# EAGLE design uncoupler-decoder (EAGLE 6.5.0)
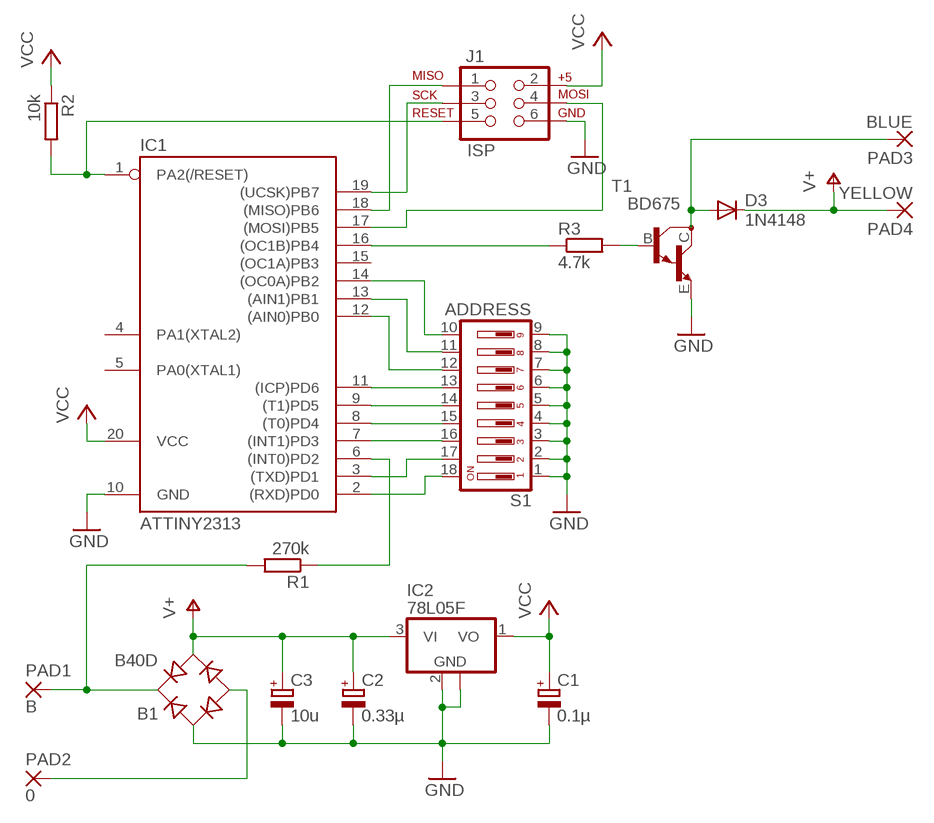
[diagram p0: schematic, sheet 1]

## Parts
B1  B40D  RECTIFIER-B40S  [B40S]
C1  0.1µ  CPOL-EUA/3216-18R  [A/3216-18R]
C2  0.33µ  CPOL-EUA/3216-18R  [A/3216-18R]
C3  10u  CPOL-EUCT6032  [CT6032]
D3  1N4148  DIODE-SOD323-R  [SOD323-R]
IC1  ATTINY2313  TINY2313-*S*  [SO20L$]
IC2  78L05F  [SOT89]
J1  ISP  AVR_ISPAVX9188MATINGGUIDE  [ISP-ADAPTER-SMD]
PAD1  B  SMD2  [SMD1,27-2,54]
PAD2  0  SMD2  [SMD1,27-2,54]
PAD3  BLUE  SMD2  [SMD1,27-2,54]
PAD4  YELLOW  SMD2  [SMD1,27-2,54]
R1  270k  R-EU_R0805  [R0805]
R2  10k  R-EU_R0805  [R0805]
R3  4.7k  R-EU_R0805  [R0805]
S1  ADDRESS  219-09  [CTS-219-09]
T1  BD675  MMBTA13LT1-NPN_DARL-SOT23-BEC  [SOT23-BEC]

## Nets
B: B1.+ PAD1.1(P) R1.2
GND: B1.AC1 C1.- C2.- C3.- IC1.10(GND) IC2.2(GND) IC2.2@1(GND) J1.6 S1.1 S1.2 S1.3 S1.4 S1.5 S1.6 S1.7 S1.8 S1.9 T1.E
N$1: R3.2 T1.B
N$2: IC1.11((ICP)PD6) S1.13
N$3: IC1.9((T1)PD5) S1.14
N$4: IC1.1(PA2(/RESET)) J1.5 R2.2
N$5: IC1.8((T0)PD4) S1.15
N$6: IC1.7((INT1)PD3) S1.16
N$7: B1.- PAD2.1(P)
N$8: IC1.16((OC1B)PB4) R3.1
N$9: D3.A PAD3.1(P) T1.C
N$10: IC1.18((MISO)PB6) J1.1
N$11: IC1.3((TXD)PD1) S1.17
N$12: IC1.19((UCSK)PB7) J1.3
N$13: IC1.17((MOSI)PB5) J1.4
N$14: IC1.14((OC0A)PB2) S1.10
N$15: IC1.13((AIN1)PB1) S1.11
N$16: IC1.12((AIN0)PB0) S1.12
N$17: IC1.2((RXD)PD0) S1.18
N$22: IC1.6((INT0)PD2) R1.1
V+: B1.AC2 C2.+ C3.+ D3.C IC2.3(VI) PAD4.1(P)
VCC: C1.+ IC1.20(VCC) IC2.1(VO) J1.2 R2.1
Unconnected: IC1.4(PA1(XTAL2)) IC1.5(PA0(XTAL1)) IC1.15((OC1A)PB3)

## Library data of the parts
B1 = rectifier:RECTIFIER-: Rectifier
C1-C3 = rcl:CPOL-EU: POLARIZED CAPACITOR, European symbol
D3 = diode:DIODE-: DIODE
IC1 = avr-6:TINY2313*: Atmel Tiny2313 2K Flash, 128 bytes EEPROM, 128 bytes RAM
IC2 = linear:78L*: POSITOIV-VOLTAGE REGULATORS Output up to 100 mA Source: http://focus.ti.com/lit/ds/symlink/ua78l05.pdf
J1 = daspilker:AVR_ISP: AVR ISP 6 Pin This is the reduced ISP connector for AVR programming. Common on Arduino. This footprint will take up less PCB space and can be used with a 10-pin to 6-pin adapter such as SKU: BOB-08508
PAD1-PAD4 = wirepad:SMD2: SMD PAD
R1-R3 = rcl:R-EU_: RESISTOR, European symbol
S1 = switch-dil:219-09*: Surface Mount DIP Switch Series 219 SMT CTS Electronic Components Sourc: www.ctscorp.com
T1 = transistor:*-NPN_DARL-: NPN Darlington Transistor

## Board
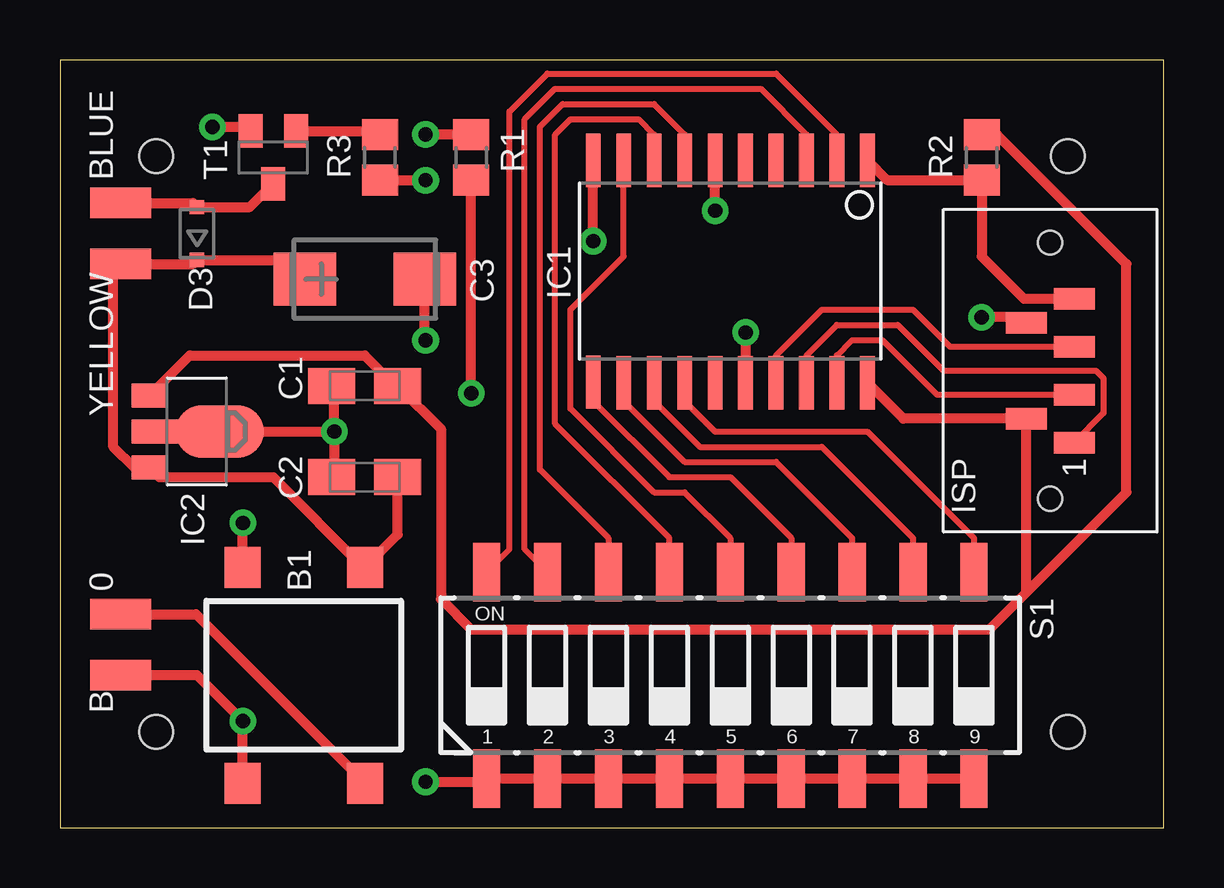
[diagram p1: board, top side]
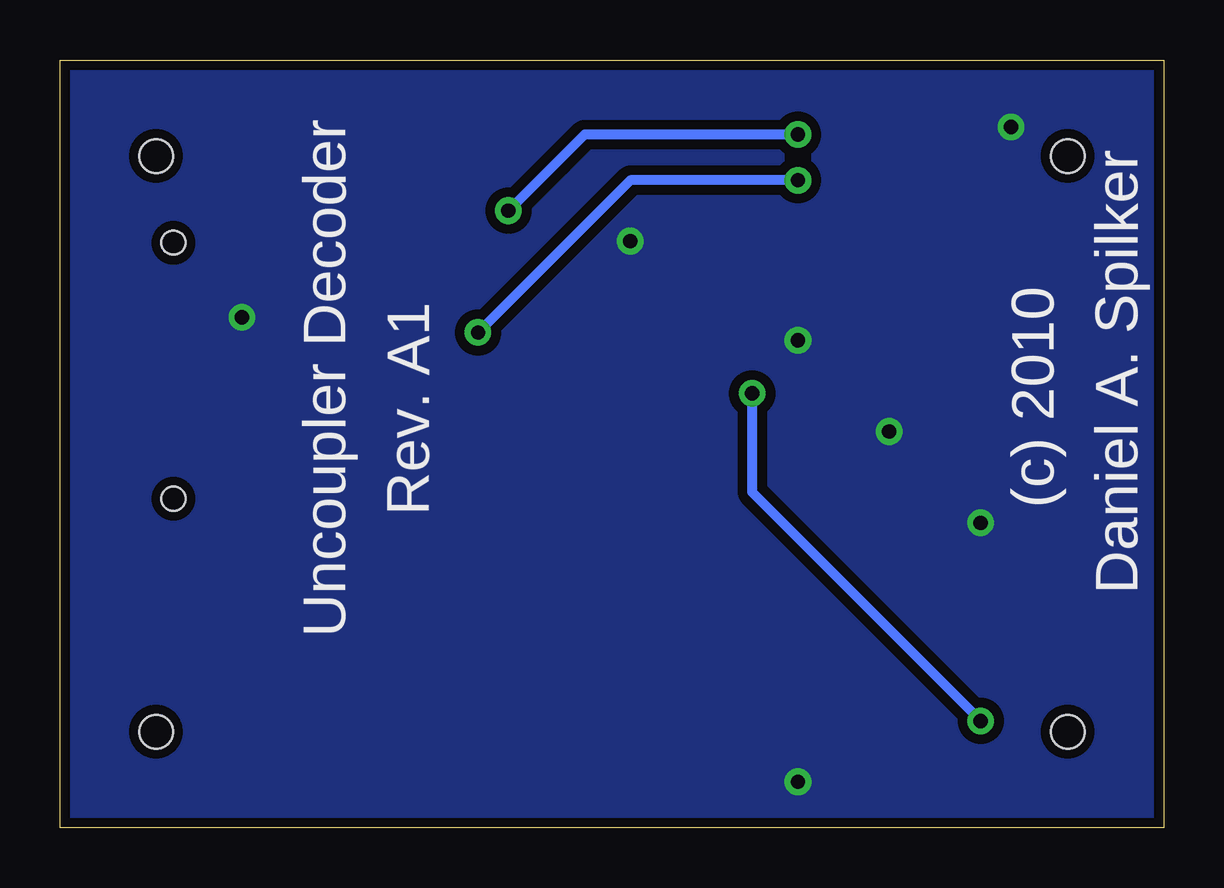
[diagram p2: board, bottom side, seen from below]

Size 46 x 32 mm. Coordinates in mm from the lower left corner, seen from the top.
Outline: 0,0 46,0 46,32 0,32 0,0
Copper layers (1*16): Top 0.035mm / dielectric 1.5mm / Bottom 0.035mm
Design rules "SparkFun": minimum track width 8mil, minimum drill 20mil, track to track 8mil, track to pad 8mil, pad to pad 8mil, via to via 8mil, smd to smd 8mil, copper to edge 10mil, drill to drill 8mil, minimum pad ring 12mil, minimum via ring 10mil, stop-mask expansion 4mil, vias tented up to drill 25mil, thermal gap 10mil
Holes 1.4 mm at 4,4 4,28 42,28 42,4

### Footprints (pad centres in the part's own frame; a part is rotated, then mirrored left to right if it is on the bottom)
B40S = smd 1.5 x 1.7: + -2.55,-4.5; - 2.55,-4.5; AC1 -2.55,4.5; AC2 2.55,4.5
A/3216-18R = smd 1.95 x 1.5: + 1.375,0; - -1.375,0
CT6032 = smd 2.6 x 2.2: + -2.5,0; - 2.5,0
SOD323-R = smd 0.6 x 0.6: A 1.1,0; C -1.1,0
SO20L$ = smd 0.61 x 2.21: 1 -5.715,-4.636; 2 -4.445,-4.636; 3 -3.175,-4.636; 4 -1.905,-4.636; 5 -0.635,-4.636; 6 0.635,-4.636; 7 1.905,-4.636; 8 3.175,-4.636; 9 4.445,-4.636; 10 5.715,-4.636; 11 5.715,4.61; 12 4.445,4.636; 13 3.175,4.636; 14 1.905,4.636; 15 0.635,4.636; 16 -0.635,4.636; 17 -1.905,4.636; 18 -3.175,4.636; 19 -4.445,4.636; 20 -5.715,4.636
SOT89 = smd 1 x 1.5: 1 -1.499,-1.981; 3 1.499,-1.981 | smd 1 x 2: 2 0,-1.727 | smd 2.2 x 3.7: 2@1 0,0.94
ISP-ADAPTER-SMD = smd 0.9 x 1.7: 1 -3,-1; 2 -2,1; 3 -1,-1; 4 1,-1; 5 3,-1; 6 2,1 | hole 1: -5.334,0; 5.334,0
SMD1,27-2,54 = smd 1.27 x 2.54: 1 0,0
R0805 = smd 1.3 x 1.5: 1 -0.95,0; 2 0.95,0
CTS-219-09 = smd 1.13 x 2.44: 1 -10.16,-4.3; 2 -7.62,-4.3; 3 -5.08,-4.3; 4 -2.54,-4.3; 5 0,-4.3; 6 2.54,-4.3; 7 5.08,-4.3; 8 7.62,-4.3; 9 10.16,-4.3; 10 10.16,4.3; 11 7.62,4.3; 12 5.08,4.3; 13 2.54,4.3; 14 0,4.3; 15 -2.54,4.3; 16 -5.08,4.3; 17 -7.62,4.3; 18 -10.16,4.3
SOT23-BEC = smd 1 x 1.4: B -0.95,-1.1; C 0,1.1; E 0.95,-1.1

### Placement (x,y rotation side)
B1  10.16,6.35 0 top
C1  12.7,18.41 0 top
C2  12.7,14.61 0 top
C3  12.7,22.86 0 top
D3  5.71,24.77 90 top
IC1  27.94,23.18 180 top
IC2  5.71,16.51 270 top
J1  41.27,19.05 90 top
PAD1  2.54,6.35 90 top
PAD2  2.54,8.89 90 top
PAD3  2.54,26.04 90 top
PAD4  2.54,23.5 90 top
R1  17.14,27.94 270 top
R2  38.42,27.94 270 top
R3  13.34,27.94 90 top
S1  27.94,6.35 0 top
T1  8.89,27.94 180 top

### Tracks (layer width: path | path; a pad name or v marks a point on that pad's centre or on a via)
B  (via drill 0.6)
  Top 0.406: B1.+ 7.61,4.43 v7.62,4.45 5.71,6.35 PAD1.1 | v17.14,18.1 R1.2
  Bottom 0.406: v17.14,18.1 17.14,13.97 v7.62,4.45
GND  (via drill 0.6)
  Top 0.254: 17.64,1.91 S1.1
  Top 0.406: S1.1 S1.2 S1.3 S1.4 S1.5 S1.6 S1.7 S1.8 S1.9 | v15.24,1.91 17.64,1.91 | IC2.2 IC2.2@1 | IC2.2@1 7.29,17.14 | v6.35,29.21 7.77,29.21 T1.E | 7.55,10.79 B1.AC1 v7.62,12.7 | v22.23,24.45 IC1.10 | IC2.2@1 v11.43,16.51 | C2.- 11.43,14.61 v11.43,16.51 | C1.- 11.43,18.41 v11.43,16.51 | C3.- 15.2,20.36 v15.24,20.32 | v38.42,21.27 40.05,21.27 J1.6
  pour Bottom (isolate 0.406): 0,0 0,32 46,32 46,0
N$1
  Top 0.406: T1.B 13.19,29.04 R3.2
N$2
  Top 0.254: S1.13 30.48,12.06 27.94,14.61 25.4,14.61 22.23,17.78 IC1.11
N$3
  Top 0.254: S1.14 27.94,12.06 26.04,13.97 24.77,13.97 21.27,17.46 21.27,21.59 23.5,23.81 IC1.9
N$4
  Top 0.406: IC1.1 34.48,26.99 R2.2 38.42,23.81 40.18,22.05 J1.5
N$5
  Top 0.254: IC1.8 24.77,28.89 24.13,29.53 21.27,29.53 20.64,28.89 20.64,16.83 25.4,12.06 S1.15
N$6
  Top 0.254: IC1.7 26.04,28.89 24.77,30.16 20.95,30.16 20,29.21 20,14.92 22.86,12.06 S1.16
N$7
  Top 0.406: PAD2.1 5.67,8.89 B1.-
N$8  (via drill 0.6)
  Top 0.406: R3.1 v15.24,26.99 | v28.57,20.64 IC1.16
  Bottom 0.406: v15.24,26.99 22.23,26.99 v28.57,20.64
N$9
  Top 0.406: PAD3.1 3.17,26.04 | PAD3.1 2.54,25.86 | PAD3.1 5.54,26.04 D3.A 7.92,25.86 T1.C
N$10
  Top 0.254: IC1.18 31.11,19.68 32.38,20.95 34.92,20.95 36.83,19.05 43.18,19.05 43.5,18.73 43.5,17.27 J1.1 42.27,16.24
N$11
  Top 0.254: S1.17 19.37,11.6 19.37,29.53 20.64,30.8 29.21,30.8 31.11,28.89 IC1.3
N$12
  Top 0.254: IC1.19 32.38,19.68 33.02,20.32 34.29,20.32 36.56,18.05 J1.3
N$13
  Top 0.254: IC1.17 29.84,19.68 31.75,21.59 35.56,21.59 37.1,20.05 J1.4
N$14
  Top 0.254: S1.10 38.1,12.06 33.66,16.51 27.3,16.51 26.04,17.78 IC1.14
N$15
  Top 0.254: S1.11 35.56,12.06 31.75,15.88 26.67,15.88 24.77,17.78 IC1.13
N$16
  Top 0.254: S1.12 33.02,12.06 29.84,15.24 26.04,15.24 23.5,17.78 IC1.12
N$17
  Top 0.254: S1.18 18.73,11.6 18.73,29.84 20.32,31.43 29.84,31.43 32.38,28.89 IC1.2
N$22  (via drill 0.6)
  Top 0.406: v27.3,25.72 IC1.6 | v15.24,28.89 R1.1
  Bottom 0.406: v27.3,25.72 24.13,28.89 v15.24,28.89
V+
  Top 0.406: C2.+ 14.07,12.21 B1.AC2 12.64,10.85 8.89,14.61 4.14,14.61 IC2.3 3.09,15.01 2.22,15.88 2.22,23.18 PAD4.1 | PAD4.1 2.54,23.66 | PAD4.1 5.54,23.5 D3.C 9.39,23.66 C3.+
VCC
  Top 0.406: 40.27,9.79 44.45,13.97 44.45,23.5 39.05,28.89 R2.1 | IC2.1 5.41,19.68 12.7,19.68 13.97,18.41 C1.+ 15.88,16.61 15.88,9.53 17.14,8.26 38.73,8.26 40.27,9.79 | IC1.20 35.15,17.05 J1.2 40.27,9.79

### Text on the board
bPlace: Uncoupler Decoder | Daniel A. Spilker | (c) 2010 | Rev. A1